# EAGLE design snowman (EAGLE 9.6.2)
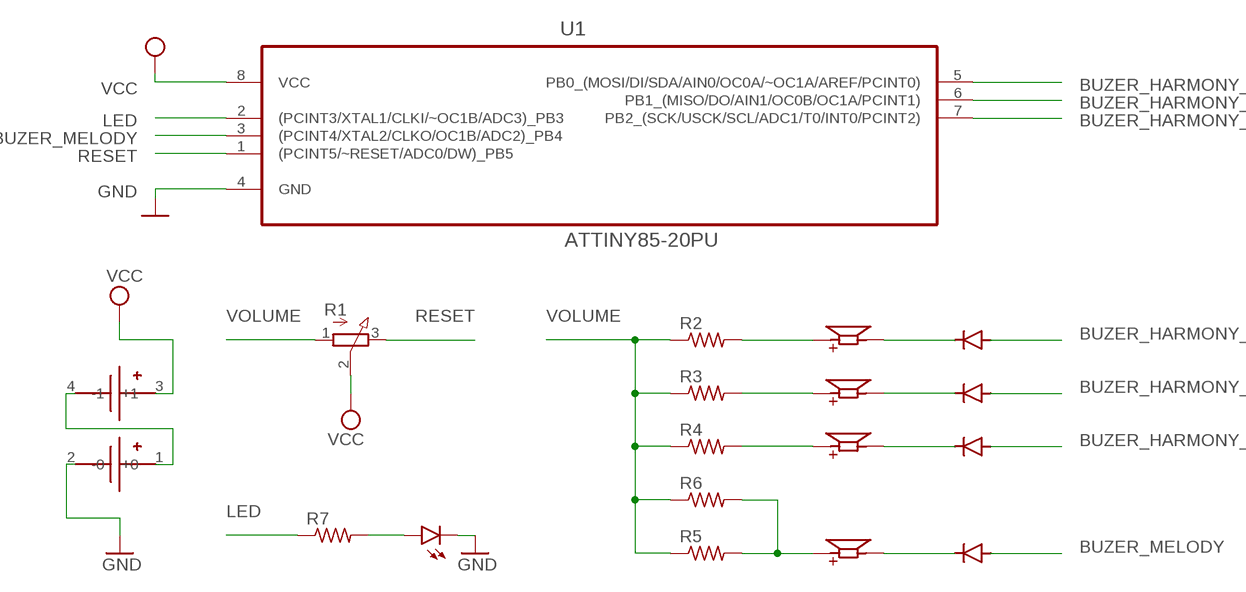
[diagram p0: schematic, sheet 1]

## Parts
D1  GF1  [SMA-DO214AC]
D2  GF1  [SMA-DO214AC]
D3  GF1  [SMA-DO214AC]
D4  GF1  [SMA-DO214AC]
LED1  LED3MM  [LED3MM]
LS1  CMT-8530S-SMT  [CUI_CMT-8530S-SMT]
LS2  CMT-8530S-SMT  [CUI_CMT-8530S-SMT]
LS3  CMT-8530S-SMT  [CUI_CMT-8530S-SMT]
LS4  CMT-8530S-SMT  [CUI_CMT-8530S-SMT]
R1  3RP/1610N  [3RP/1610N]
R2  R-US_R0805  [R0805]
R3  R-US_R0805  [R0805]
R4  R-US_R0805  [R0805]
R5  R-US_R0805  [R0805]
R6  R-US_R0805  [R0805]
R7  R-US_R0805  [R0805]
U1  ATTINY85-20PU  [DIP254P762X533-8]
U$1  BLOSSOM-BLM-18650-2PCS  [BLOSSOM-BLM-18650-2PCS]

## Nets
BUZER_HARMONY_1: D4.A U1.7(PB2_(SCK/USCK/SCL/ADC1/T0/INT0/PCINT2))
BUZER_HARMONY_2: D3.A U1.6(PB1_(MISO/DO/AIN1/OC0B/OC1A/PCINT1))
BUZER_HARMONY_3: D2.A U1.5(PB0_(MOSI/DI/SDA/AIN0/OC0A/~OC1A/AREF/PCINT0))
BUZER_MELODY: D1.A U1.3((PCINT4/XTAL2/CLKO/OC1B/ADC2)_PB4)
GND: LED1.K(C) U1.4(GND) U$1.2(-0)
LED: R7.1 U1.2((PCINT3/XTAL1/CLKI/~OC1B/ADC3)_PB3)
N$2: LS4.P R3.2
N$3: LS2.P R2.2
N$4: LS3.P R4.2
N$5: LED1.A R7.2
N$6: LS1.P R5.2 R6.2
N$7: D4.K(C) LS2.N
N$8: D3.K(C) LS4.N
N$9: D2.K(C) LS3.N
N$10: D1.K(C) LS1.N
N$12: U$1.1(+0) U$1.4(-1)
RESET: R1.3(E) U1.1((PCINT5/~RESET/ADC0/DW)_PB5)
VCC: R1.2(S) U1.8(VCC) U$1.3(+1)
VOLUME: R1.1(A) R2.1 R3.1 R4.1 R5.1 R6.1

## Library data of the parts
D1-D4 = diode:GF1: DIODE
LED1 = led:LED: LED OSRAM: - CHIPLED LG R971, LG N971, LY N971, LG Q971, LY Q971, LO R971, LY R971 LH N974, LH R974 LS Q976, LO Q976, LY Q976 LO Q996 - Hyper CHIPLED LW Q18S LB Q993, LB Q99A, LB R99A - SideLED LS A670, LO A670, LY A670, LG A670, LP A670 LB A673, LV A673, LT A673, LW A673 LH A674 LY A675 LS A676, LA A676, LO A676, LY A676, LW A676 LS A679, LY A679, LG A679 - Hyper Micro SIDELED® LS Y876, LA Y876, LO Y876, LY Y876 LT Y87S - SmartLED LW L88C, LW L88S LB L89C, LB L89S, LG L890 LS L89K, LO L89K, LY L89K LS L896, LA L896, LO L896, LY L896 - TOPLED LS T670, LO T670, LY T670, LG T670, LP T670 LSG T670, LSP T670, LSY T670, LOP T670, LYG T670 LG T671, LOG T671, LSG T671 LB T673, LV T673, LT T673, LW T673 LH T674 LS T676, LA T676, LO T676, LY T676, LB T676, LH T676, LSB T676, LW T676 LB T67C, LV T67C, LT T67C, LS T67K, LO T67K, LY T67K, LW E67C LS E67B, LA E67B, LO E67B, LY E67B, LB E67C, LV E67C, LT E67C LW T67C LS T679, LY T679, LG T679 LS T770, LO T770, LY T770, LG T770, LP T770 LB T773, LV T773, LT T773, LW T773 LH T774 LS E675, LA E675, LY E675, LS T675 LS T776, LA T776, LO T776, LY T776, LB T776 LHGB T686 LT T68C, LB T68C - Hyper Mini TOPLED® LB M676 - Mini TOPLED Santana® LG M470 LS M47K, LO M47K, LY M47K Source: http://www.osram.convergy.de LUXEON: - LUMILED® LXK2-PW12-R00, LXK2-PW12-S00, LXK2-PW14-U00, LXK2-PW14-V00 LXK2-PM12-R00, LXK2-PM12-S00, LXK2-PM14-U00 LXK2-PE12-Q00, LXK2-PE12-R00, LXK2-PE12-S00, LXK2-PE14-T00, LXK2-PE14-U00 LXK2-PB12-K00, LXK2-PB12-L00, LXK2-PB12-M00, LXK2-PB14-N00, LXK2-PB14-P00, LXK2-PB14-Q00 LXK2-PR12-L00, LXK2-PR12-M00, LXK2-PR14-Q00, LXK2-PR14-R00 LXK2-PD12-Q00, LXK2-PD12-R00, LXK2-PD12-S00 LXK2-PH12-R00, LXK2-PH12-S00 LXK2-PL12-P00, LXK2-PL12-Q00, LXK2-PL12-R00 Source: www.luxeon.com KINGBRIGHT: KA-3528ASYC Source: www.kingbright.com
LS1-LS4 = CMT-8530S-SMT:CMT-8530S-SMT: 8.5 mm, 3.6 Vo-p, 90 dB, Surface Mount (SMT), Magnetic Audio Transducer Buzzer Check prices <https://pricing.snapeda.com/parts/CMT-8530S-SMT-TR/CUI%20Devices/view-part?ref=eda>; AVAILABILITY: Good; CUI_PURCHASE_URL: https://www.cuidevices.com/product/audio/buzzers/audio-transducers/cmt-8530s-smt-tr?utm_source=snapeda.com&utm_medium=referral&utm_campaign=snapedaBOM; DESCRIPTION: 8.5 mm, 3.6 Vo-p, 90 dB, Surface Mount (SMT), Magnetic Audio Transducer Buzzer; MF: CUI Devices; MP: CMT-8530S-SMT-TR; PACKAGE: CUI; PRICE: None; PURCHASE-URL: https://pricing.snapeda.com/search/part/CMT-8530S-SMT-TR/?ref=eda
R1 = pot:3RP/1610N: 16mm Potentiometer one level Source: http://www.alphapotentiometers.net/html/16mm_pot_2.html
R2-R7 = rcl:R-US_: RESISTOR, American symbol; SPICEPREFIX: R
U1 = ATTINY85-20PU:ATTINY85-20PU: 8-bit Microcontroller with In-System Programmable Flash Check prices <https://pricing.snapeda.com/parts/ATTINY85-20PU/Microchip/view-part?ref=eda>; AVAILABILITY: Good; DESCRIPTION: AVR AVR® ATtiny, Functional Safety (FuSa) Microcontroller IC 8-Bit 20MHz 8KB (4K x 16) FLASH 8-PDIP; MF: Microchip; MP: ATTINY85-20PU; PACKAGE: DIP-8 Microchip; PRICE: None; PURCHASE-URL: https://pricing.snapeda.com/search/part/ATTINY85-20PU/?ref=eda
U$1 = battery-holders:BLOSSOM-BLM-18650-2PCS

## Board
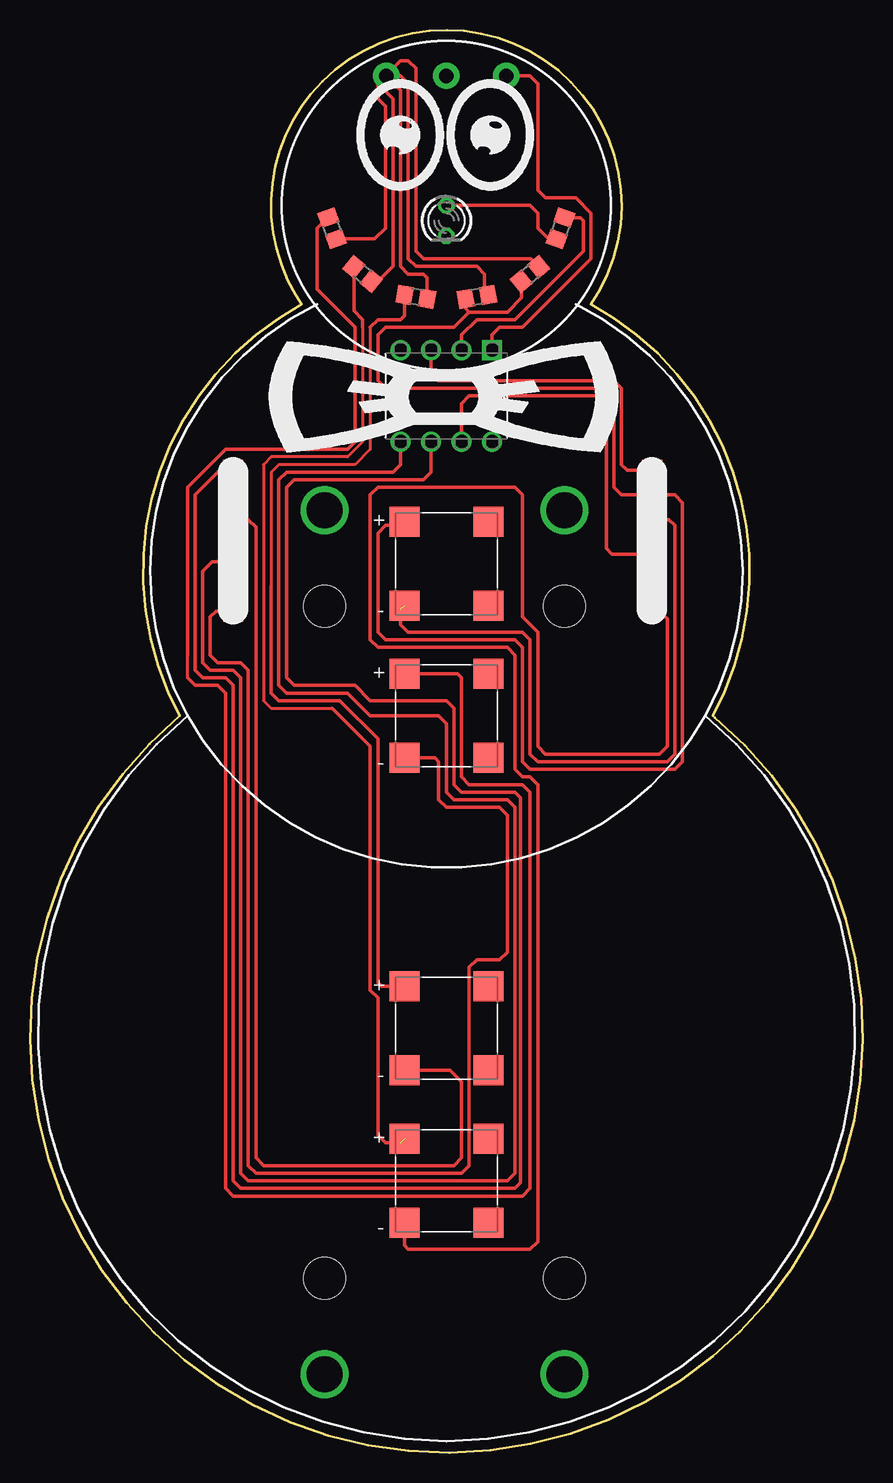
[diagram p1: board, top side]
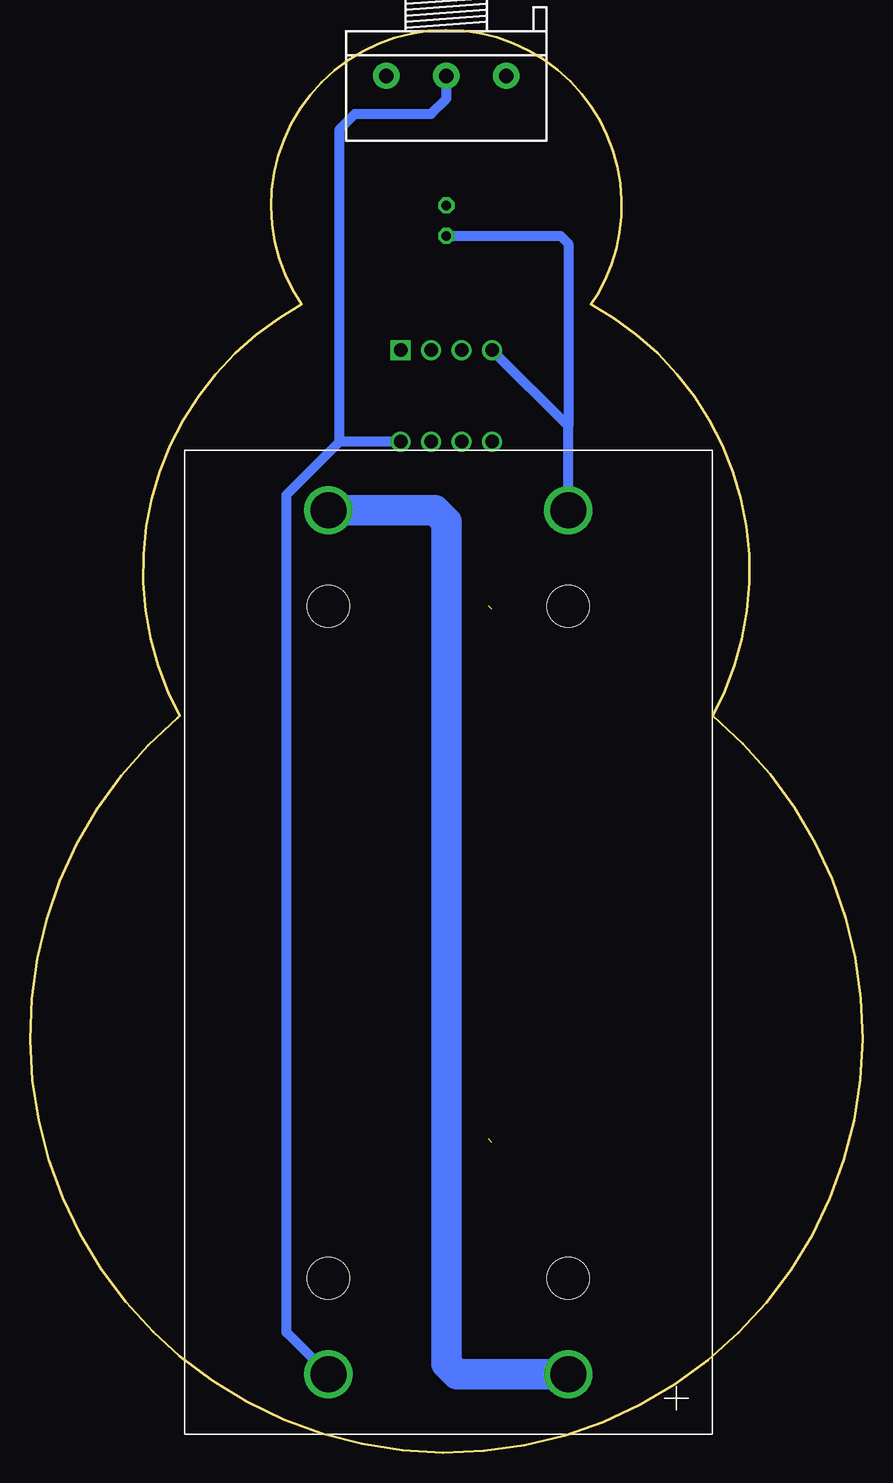
[diagram p2: board, bottom side, seen from below]

Size 69.43 x 118.55 mm. Coordinates in mm from the lower left corner, seen from the top.
Outline: 12.49,61.39 arc180 56.94,8.05 59.18,10.08 arc95 57.12,61.23 56.94,61.39 57.91,63.37 arc80 48.67,94.54 46.78,95.68 arc175 23.42,113.21 22.65,112.19 arc65 22.13,96.48 22.65,95.68 20.76,94.54 arc80 11.52,63.37 12.49,61.39
Copper layers (1*16): Top 0.035mm / dielectric 1.5mm / Bottom 0.035mm
Design rules "default": minimum track width 6mil, minimum drill 0.35mm, track to track 6mil, track to pad 6mil, pad to pad 6mil, via to via 6mil, smd to smd 6mil, copper to edge 40mil, drill to drill 6mil, minimum pad ring 10mil, minimum via ring 8mil, stop-mask expansion 4mil, vias tented up to drill 0mil, thermal gap 10mil

### Footprints (pad centres in the part's own frame; a part is rotated, then mirrored left to right if it is on the bottom)
SMA-DO214AC = smd 1.8 x 1.7: A -2.05,0; K 2.05,0
LED3MM = drill 0.813 octagon: A -1.27,0; K 1.27,0
CUI_CMT-8530S-SMT = smd 2.5 x 2.5: 1 -3.5,3.5; 2 -3.5,-3.5; N 3.5,3.5; P 3.5,-3.5
3RP/1610N = drill 1.2 pad 2.184: 1 -5,0; 2 0,0; 3 5,0
R0805 = smd 1.3 x 1.5: 1 -0.95,0; 2 0.95,0
DIP254P762X533-8 = drill 1.118 square: 1 -7.62,7.62 | drill 1.118: 2 -7.62,5.08; 3 -7.62,2.54; 4 -7.62,0; 5 0,0; 6 0,2.54; 7 0,5.08; 8 0,7.62
BLOSSOM-BLM-18650-2PCS = drill 3: 1 -72,0; 2 0,0; 3 -72,20; 4 0,20 | hole 3.5: -64,0; -8,0; -64,20; -8,20

### Placement (x,y rotation side)
D1  51.86,79.8 270 top
D2  16.94,72.18 270 top
D3  16.94,79.8 270 top
D4  51.86,72.82 270 top
LED1  34.72,102.66 270 top
LS1  34.72,74.09 180 top
LS2  34.72,22.65 180 top
LS3  34.72,61.39 180 top
LS4  34.72,35.35 180 top
R1  34.72,114.73 180 bottom
R2  27.73,98.22 140 top
R3  32.18,96.31 170 top
R4  25.19,102.03 110 top
R5  37.26,96.31 190 top
R6  41.7,98.22 220 top
R7  44.24,102.03 250 top
U1  30.91,84.25 270 top
U$1  24.56,78.53 90 bottom

### Tracks (layer width: path | path; a pad name or v marks a point on that pad's centre or on a via)
BUZER_HARMONY_1
  Top 0.305: U1.7 35.99,87.42 36.62,88.06 47.42,88.06 48.05,87.42 48.05,75.36 48.54,74.87 D4.A
BUZER_HARMONY_2
  Top 0.305: U1.6 33.45,81.71 32.81,81.07 22.02,81.07 21.38,80.44 21.38,64.56 22.02,63.93 27.1,63.93 28.37,62.66 34.72,62.66 35.35,62.02 35.35,55.67 35.99,55.04 40.43,55.04 40.89,54.58 40.89,22.47 40.43,22.02 17.57,22.02 16.94,22.65 16.94,63.93 16.3,64.56 14.4,64.56 13.76,65.2 13.76,79.8 15.81,81.85 D3.A
BUZER_HARMONY_3
  Top 0.305: U1.5 30.91,82.34 30.27,81.71 21.38,81.71 20.75,81.07 20.75,63.93 21.38,63.29 26.46,63.29 28.37,61.39 34.08,61.39 34.72,60.75 34.72,55.04 35.35,54.4 39.8,54.4 40.43,53.77 40.43,23.29 39.8,22.65 18.21,22.65 17.57,23.29 17.57,64.56 16.94,65.2 15.03,65.2 14.4,65.83 14.4,73.45 15.18,74.23 D2.A
BUZER_MELODY
  Top 0.305: U1.3 33.45,89.96 34.08,89.33 48.69,89.33 49.32,88.69 49.32,82.34 49.81,81.85 D1.A
GND
  Bottom 0.813: U$1.2 24.56,85.52 | 24.56,85.52 24.56,100.76 25.19,101.39 LED1.K | U1.4 24.56,85.52
LED
  Top 0.305: R7.1 45.89,102.92 46.15,102.66 46.15,100.12 40.43,94.41 37.26,94.41 35.99,93.14 U1.2
N$2
  Top 0.254: 20.11,72.18 20.11,81.71 20.75,82.34 27.1,82.34 28.37,83.61 28.37,93.77
  Top 0.305: 31.45,96.85 R3.2 31.24,94.74 30.91,94.41 29,94.41 28.37,93.77 | LS4.P 29.31,38.85 29,39.16 29,59.48 25.83,62.66 20.75,62.66 20.11,63.29 20.11,72.18
N$3  (1 unrouted)
  Top 0.254: 27.73,93.77 27.73,84.25 26.46,82.98 20.11,82.98 19.48,82.34 19.48,62.66 20.11,62.02 25.19,62.02
  Top 0.305: R2.2 27,95.13 27.73,94.41 27.73,93.77 | 25.19,62.02 28.37,58.85 28.37,38.53 29,37.89 29,26.46 29.64,25.83 30.91,25.83
N$4
  Top 0.254: 13.13,64.56 13.13,66.47
  Top 0.305: LS3.P 35.66,64.89 35.99,64.56 35.99,56.31 36.62,55.67 41.07,55.67 41.7,55.04 41.7,22.02 41.07,21.38 16.94,21.38 16.3,22.02 16.3,63.29 15.67,63.93 13.76,63.93 13.13,64.56 | 13.13,66.47 13.13,80.44 16.3,83.61 26.46,83.61 27.1,84.25 27.1,93.77 23.92,96.95 23.92,102.03 24.56,102.66 24.61,102.66 R4.2
N$5
  Top 0.305: LED1.A 41.7,103.93 42.34,103.3 42.34,102.03 43.23,101.13 R7.2
N$6
  Top 0.305: R6.2 40.97,96.22 39.8,95.04 36.62,95.04 | 36.62,95.04 36.32,95.34 R5.2 | 36.62,95.04 35.35,93.77 29.64,93.77 29,93.14 29,89.33 29.64,88.69 48.05,88.69 48.69,88.06 48.69,80.44 49.32,79.8 53.77,79.8 54.4,79.17 54.4,57.58 53.77,56.94 41.7,56.94 41.07,57.58 41.07,67.1 40.43,67.74 29.64,67.74 29,68.37 29,76.63 29.64,77.26 30.89,77.26 LS1.P
N$7
  Top 0.305: LS2.N 31.22,17.26 31.54,16.94 41.7,16.94 42.34,17.57 42.34,55.67 41.7,56.31 41.07,56.31 40.43,56.94 40.43,66.47 39.8,67.1 29,67.1 28.37,67.74 28.37,79.8 29,80.44 40.43,80.44 41.07,79.8 41.07,69.64 42.34,68.37 42.34,58.85 42.97,58.21 52.5,58.21 53.13,58.85 53.13,69.5 D4.K
N$8
  Top 0.305: D3.K 16.79,77.9 | 17.08,77.9 D3.K | LS4.N 35.04,31.85 35.99,30.91 35.99,24.56 35.35,23.92 19.48,23.92 18.84,24.56 18.84,77.12 18.21,77.75 D3.K
N$9
  Top 0.305: D2.K 15.52,70.13 15.03,69.64 15.03,66.47 15.67,65.83 17.57,65.83 18.21,65.2 18.21,23.92 18.84,23.29 35.99,23.29 36.62,23.92 36.62,40.43 37.26,41.07 39.16,41.07 39.8,41.7 39.8,53.13 39.16,53.77 34.72,53.77 34.08,54.4 34.08,57.58 33.77,57.89 LS3.N
N$10  (1 unrouted)
  Top 0.305: D1.K 53.28,77.75 53.77,77.26 53.77,58.21 53.13,57.58 42.34,57.58 41.7,58.21 41.7,67.74 41.07,68.37 31.54,68.37 30.91,69.01 30.91,70.28
N$12
  Bottom 2.54: U$1.4 35.67,78.53 34.72,77.58 34.72,7.41 33.84,6.53 U$1.1
RESET
  Top 0.305: R1.3 41.7,114.73 42.34,114.09 42.34,105.2 42.97,104.57 45.51,104.57 46.78,103.3 46.78,99.49 41.07,93.77 39.16,93.77 38.53,93.14 U1.1
VCC
  Bottom 0.813: U$1.3 48.05,10.03 48.05,79.8 43.61,84.25 | U1.8 43.61,84.25 | 43.61,84.25 43.61,110.28 42.34,111.55 35.99,111.55 34.72,112.82 R1.2
VOLUME
  Top 0.305: R5.1 37.89,96.78 37.89,98.22 37.26,98.85 32.18,98.85 31.54,99.49 31.54,114.09 30.91,114.73 R1.1 | R1.1 29.72,114.81 30.91,116 31.54,116 32.18,115.36 32.18,100.12 32.81,99.49 41.77,99.49 R6.1 | R1.1 30.91,113.54 30.91,98.85 31.54,98.22 32.81,98.22 33.11,97.91 R3.1 | R1.1 29.72,113.38 30.27,112.82 30.27,98.85 29.02,97.6 R2.1 | R1.1 29.64,114.73 29,114.09 29,112.82 29.64,112.19 29.64,102.03 28.74,101.13 R4.1